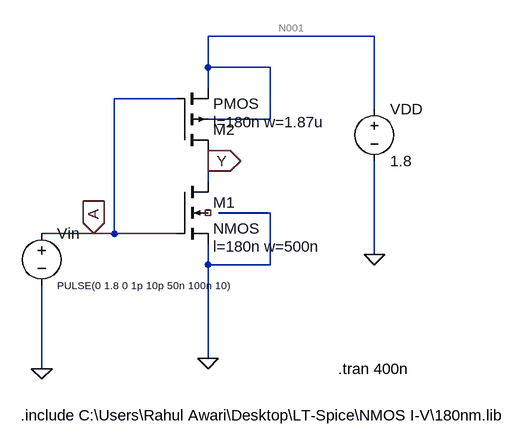
[diagram p0: schematic Cmostrans.asc]
Cmostrans.asc, the LTspice schematic file:
Version 4
SHEET 1 880 680
WIRE 432 48 176 48
WIRE 176 96 176 48
WIRE 272 96 176 96
WIRE 176 128 176 96
WIRE 128 144 32 144
WIRE 432 160 432 48
WIRE 272 176 272 96
WIRE 272 176 176 176
WIRE 176 240 176 224
WIRE 176 272 176 240
WIRE 272 320 192 320
WIRE 0 352 -80 352
WIRE 32 352 32 144
WIRE 32 352 0 352
WIRE 128 352 32 352
WIRE 432 384 432 240
WIRE 176 400 176 368
WIRE 272 400 272 320
WIRE 272 400 176 400
WIRE 176 544 176 400
WIRE -80 560 -80 432
FLAG 176 544 0
FLAG 432 384 0
FLAG -80 560 0
FLAG 0 352 A
IOPIN 0 352 In
FLAG 176 240 Y
IOPIN 176 240 Out
SYMBOL nmos4 128 272 R0
WINDOW 123 56 100 Left 2
SYMATTR Value2 l=180n w=500n
SYMATTR InstName M1
SYMBOL pmos4 128 224 M180
WINDOW 123 56 44 Left 2
SYMATTR Value2 l=180n w=1.87u
SYMATTR InstName M2
SYMBOL voltage 432 144 R0
WINDOW 123 0 0 Left 0
WINDOW 39 0 0 Left 0
SYMATTR InstName VDD
SYMATTR Value 1.8
SYMBOL voltage -80 336 R0
WINDOW 3 24 96 Left 1
WINDOW 123 0 0 Left 0
WINDOW 39 0 0 Left 0
SYMATTR Value PULSE(0 1.8 0 1p 10p 50n 100n 10)
SYMATTR InstName Vin
TEXT -112 632 Left 2 !.include C:\\Users\\Rahul Awari\\Desktop\\LT-Spice\\NMOS I-V\\180nm.lib
TEXT 376 560 Left 2 !.tran 400n

The netlist it stands for:
* Cmostrans.asc
M1 Y A 0 NC_01 NMOS l=180n w=500n
M2 Y A N001 N001 PMOS l=180n w=1.87u
VDD N001 0 1.8
Vin A 0 PULSE(0 1.8 0 1p 10p 50n 100n 10)
.model NMOS NMOS
.model PMOS PMOS
.lib standard.mos
.include C:\Users\Rahul Awari\Desktop\LT-Spice\NMOS I-V\180nm.lib
.tran 400n
.backanno
.end

* Results of the author's LTspice run, read from the files saved beside the schematic
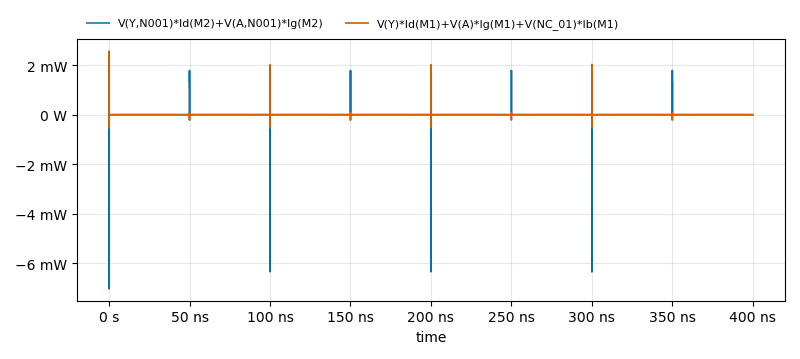
[diagram p1: Transient Analysis of Cmostrans.asc, plotted from the saved traces]
* Transient Analysis, 1 run:
*   V(Y,N001)*Id(M2)+V(A,N001)*Ig(M2): min -7.039 mW, max 1.787 mW, average 125.3 nW, rms 18.06 µW, last 0 W
*   V(Y)*Id(M1)+V(A)*Ig(M1)+V(NC_01)*Ib(M1): min -539.6 µW, max 2.564 mW, average 61.61 nW, rms 6.805 µW, last 0 W